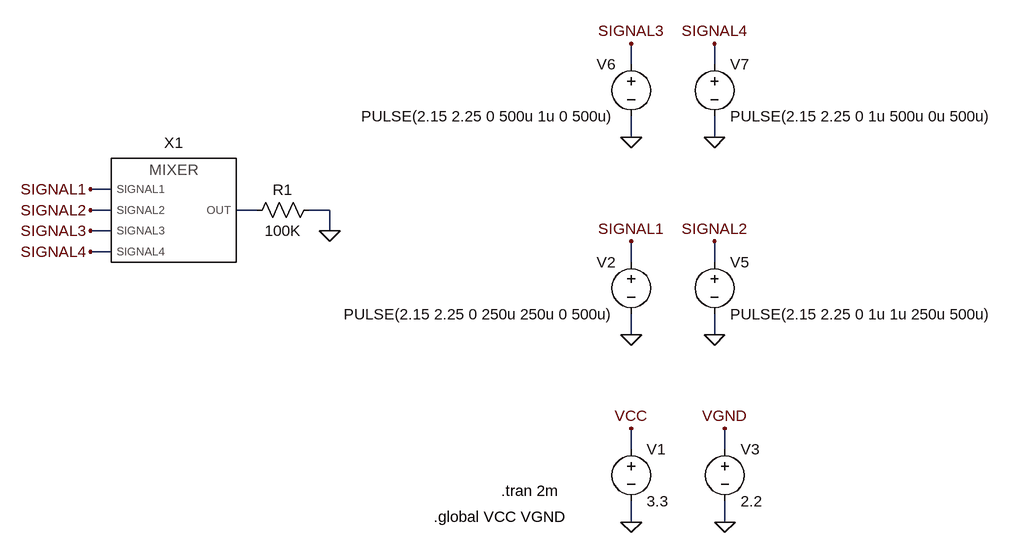
[diagram p0: schematic test_mixer.asc]
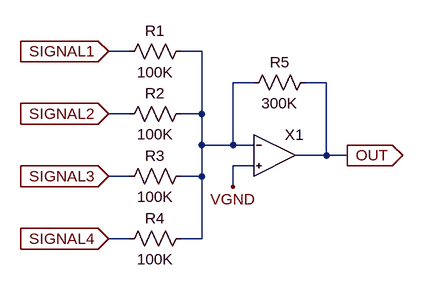
[diagram p1: sub-circuit mixer.asc]
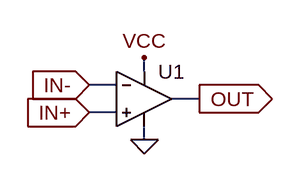
[diagram p2: sub-circuit opamp.asc]
test_mixer.asc, the LTspice schematic file:
Version 4
SHEET 1 1908 768
WIRE 896 -64 896 -96
WIRE 1024 -64 1024 -96
WIRE 896 48 896 16
WIRE 1024 48 1024 16
WIRE 96 128 64 128
WIRE 96 160 64 160
WIRE 320 160 288 160
WIRE 432 160 400 160
WIRE 96 192 64 192
WIRE 432 192 432 160
WIRE 96 224 64 224
WIRE 896 240 896 208
WIRE 1024 240 1024 208
WIRE 896 352 896 320
WIRE 1024 352 1024 320
WIRE 896 528 896 496
WIRE 1040 528 1040 496
WIRE 896 640 896 608
WIRE 1040 640 1040 608
FLAG 432 192 0
FLAG 896 640 0
FLAG 896 496 VCC
FLAG 896 352 0
FLAG 896 208 SIGNAL1
FLAG 64 128 SIGNAL1
FLAG 64 160 SIGNAL2
FLAG 64 192 SIGNAL3
FLAG 64 224 SIGNAL4
FLAG 1024 352 0
FLAG 1024 208 SIGNAL2
FLAG 896 48 0
FLAG 896 -96 SIGNAL3
FLAG 1024 48 0
FLAG 1024 -96 SIGNAL4
FLAG 1040 640 0
FLAG 1040 496 VGND
SYMBOL res 416 144 R90
WINDOW 0 0 56 VBottom 2
WINDOW 3 32 56 VTop 2
SYMATTR InstName R1
SYMATTR Value 100K
SYMBOL voltage 896 512 R0
WINDOW 123 0 0 Left 0
WINDOW 39 0 0 Left 0
SYMATTR InstName V1
SYMATTR Value 3.3
SYMBOL voltage 896 224 M0
WINDOW 123 0 0 Left 0
WINDOW 39 0 0 Left 0
SYMATTR InstName V2
SYMATTR Value PULSE(2.15 2.25 0 250u 250u 0 500u)
SYMBOL voltage 1024 224 R0
WINDOW 123 0 0 Left 0
WINDOW 39 0 0 Left 0
SYMATTR InstName V5
SYMATTR Value PULSE(2.15 2.25 0 1u 1u 250u 500u)
SYMBOL voltage 896 -80 M0
WINDOW 123 0 0 Left 0
WINDOW 39 0 0 Left 0
SYMATTR InstName V6
SYMATTR Value PULSE(2.15 2.25 0 500u 1u 0 500u)
SYMBOL voltage 1024 -80 R0
WINDOW 123 0 0 Left 0
WINDOW 39 0 0 Left 0
SYMATTR InstName V7
SYMATTR Value PULSE(2.15 2.25 0 1u 500u 0u 500u)
SYMBOL mixer 192 192 R0
SYMATTR InstName X1
SYMBOL voltage 1040 512 R0
WINDOW 123 0 0 Left 0
WINDOW 39 0 0 Left 0
SYMATTR InstName V3
SYMATTR Value 2.2
TEXT 696 592 Left 2 !.tran 2m
TEXT 592 632 Left 2 !.global VCC VGND

mixer.asc, the sub-circuit schematic file:
Version 4
SHEET 1 880 680
WIRE 128 16 96 16
WIRE 240 16 208 16
WIRE 320 64 288 64
WIRE 432 64 400 64
WIRE 128 112 96 112
WIRE 240 112 240 16
WIRE 240 112 208 112
WIRE 240 160 240 112
WIRE 288 160 288 64
WIRE 288 160 240 160
WIRE 320 160 288 160
WIRE 432 176 432 64
WIRE 432 176 384 176
WIRE 464 176 432 176
WIRE 320 192 288 192
WIRE 128 208 96 208
WIRE 240 208 240 160
WIRE 240 208 208 208
WIRE 288 224 288 192
WIRE 128 304 96 304
WIRE 240 304 240 208
WIRE 240 304 208 304
FLAG 96 16 SIGNAL1
IOPIN 96 16 In
FLAG 96 112 SIGNAL2
IOPIN 96 112 In
FLAG 96 208 SIGNAL3
IOPIN 96 208 In
FLAG 96 304 SIGNAL4
IOPIN 96 304 In
FLAG 288 224 VGND
FLAG 464 176 OUT
IOPIN 464 176 Out
SYMBOL res 224 0 R90
WINDOW 0 0 56 VBottom 2
WINDOW 3 32 56 VTop 2
SYMATTR InstName R1
SYMATTR Value 100K
SYMBOL res 224 96 R90
WINDOW 0 0 56 VBottom 2
WINDOW 3 32 56 VTop 2
SYMATTR InstName R2
SYMATTR Value 100K
SYMBOL res 224 192 R90
WINDOW 0 0 56 VBottom 2
WINDOW 3 32 56 VTop 2
SYMATTR InstName R3
SYMATTR Value 100K
SYMBOL res 224 288 R90
WINDOW 0 0 56 VBottom 2
WINDOW 3 32 56 VTop 2
SYMATTR InstName R4
SYMATTR Value 100K
SYMBOL opamp 352 176 R0
SYMATTR InstName X1
SYMBOL res 416 48 R90
WINDOW 0 0 56 VBottom 2
WINDOW 3 32 56 VTop 2
SYMATTR InstName R5
SYMATTR Value 300K

opamp.asc, the sub-circuit schematic file:
Version 4
SHEET 1 880 680
WIRE 144 144 144 128
WIRE 112 160 80 160
WIRE 208 176 176 176
WIRE 112 192 80 192
WIRE 144 224 144 208
FLAG 144 224 0
FLAG 144 128 VCC
FLAG 208 176 OUT
IOPIN 208 176 Out
FLAG 80 192 IN+
IOPIN 80 192 In
FLAG 80 160 IN-
IOPIN 80 160 In
SYMBOL Opamps\\UniversalOpamp2 144 176 R0
SYMATTR InstName U1
SYMATTR Value2 Avol=1Meg GBW=1.2Meg Slew=10Meg

The netlist it stands for:
* test_mixer.asc
R1 0 N001 100K
V1 VCC 0 3.3
V2 SIGNAL1 0 PULSE(2.15 2.25 0 250u 250u 0 500u)
V5 SIGNAL2 0 PULSE(2.15 2.25 0 1u 1u 250u 500u)
V6 SIGNAL3 0 PULSE(2.15 2.25 0 500u 1u 0 500u)
V7 SIGNAL4 0 PULSE(2.15 2.25 0 1u 500u 0u 500u)
XX1 SIGNAL1 SIGNAL2 SIGNAL3 SIGNAL4 N001 mixer
V3 VGND 0 2.2

* block symbol definitions
.subckt mixer SIGNAL1 SIGNAL2 SIGNAL3 SIGNAL4 OUT
R1 N001 SIGNAL1 100K
R2 N001 SIGNAL2 100K
R3 N001 SIGNAL3 100K
R4 N001 SIGNAL4 100K
XX1 VGND N001 OUT opamp
R5 OUT N001 300K
.ends mixer

.subckt opamp IN+ IN- OUT
XU1 IN+ IN- VCC 0 OUT level.2 Avol=1Meg GBW=1.2Meg Slew=10Meg ilimit=25m rail=0 Vos=0 phimargin=45 en=0 enk=0 in=0 ink=0 Rin=500Meg  ; pins IN+ IN- V+ V- OUT
.ends opamp

.tran 2m
.global VCC VGND
.lib UniversalOpamps2.sub
.backanno
.end